# Altium schematic sheet READ_2.SchDoc: FMC-320U
size A4; Author: DHS; SheetNumber: 1; SheetTotal: 7; thisVersion: 1; ThisRevision: 2; Release: 1
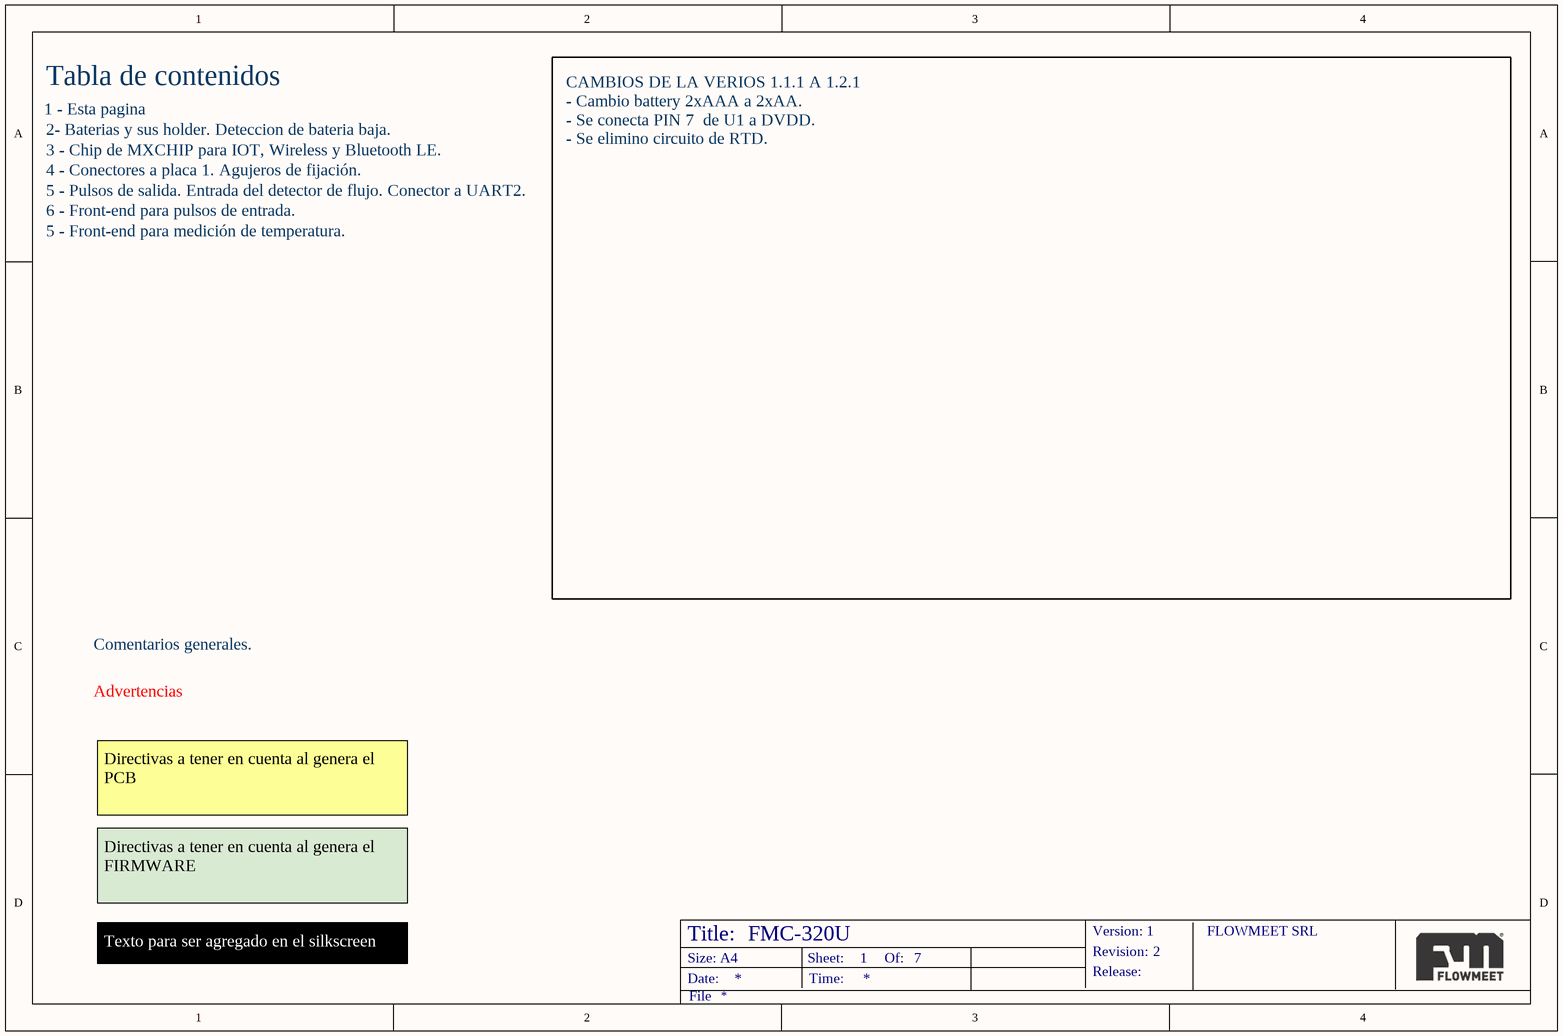
[diagram p0: READ_2.SchDoc]

## Notes on the sheet
- 1 - Esta pagina
- Tabla de contenidos
- 2- Baterias y sus holder. Deteccion de bateria baja.
- 3 - Chip de MXCHIP para IOT, Wireless y Bluetooth LE.
- 4 - Conectores a placa 1. Agujeros de fijación.
- 5 - Pulsos de salida. Entrada del detector de flujo. Conector a UART2.
- 6 - Front-end para pulsos de entrada.
- 5 - Front-end para medición de temperatura.
- CAMBIOS DE LA VERIOS 1.1.1 A 1.2.1
  - Cambio battery 2xAAA a 2xAA.
  - Se conecta PIN 7  de U1 a DVDD.
  - Se elimino circuito de RTD.
- Advertencias
- Comentarios generales.
- Directivas a tener en cuenta al genera el PCB
- Directivas a tener en cuenta al genera el FIRMWARE
- Texto para ser agregado en el silkscreen
- Title:
- Size: A4
- Date:
- Sheet:
- Time:
- Of:
- Version:
- Revision:
- Release:
- FLOWMEET SRL
- File